# EAGLE design 5G8_fpv_tx (EAGLE 7.2.0)
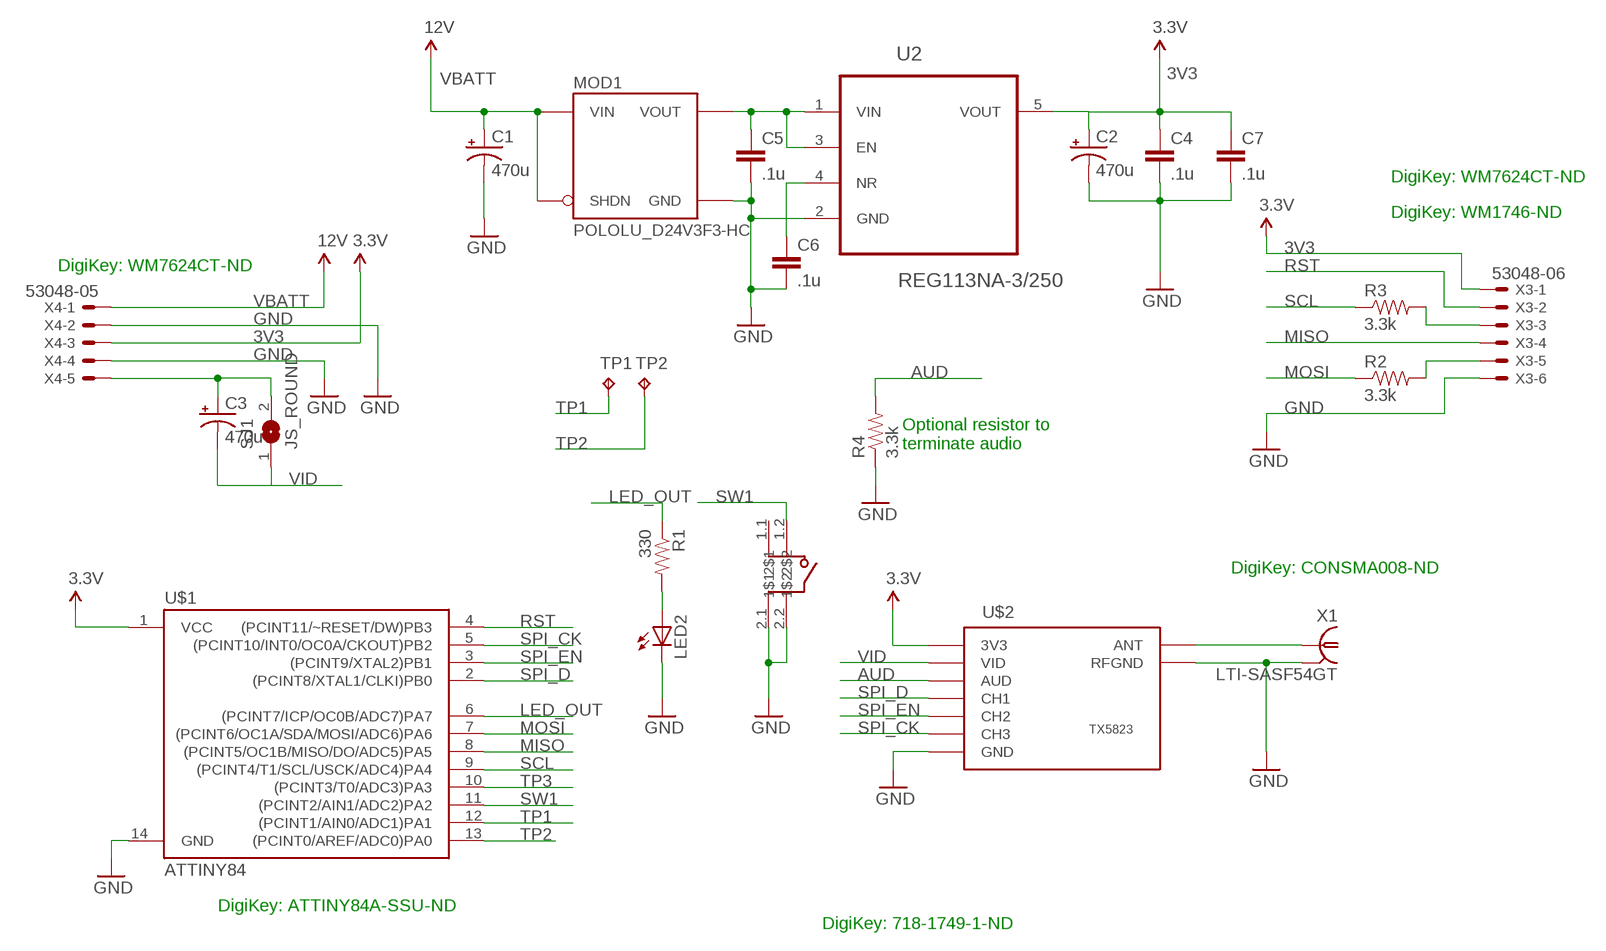
[diagram p0: schematic, sheet 1]

## Parts
C1  470u  VISHAY_D  [VISHAY_D]
C2  470u  VISHAY_D  [VISHAY_D]
C3  470u  VISHAY_D  [VISHAY_D]
C4  .1u  CAP0805  [0805]
C5  .1u  CAP0805  [0805]
C6  .1u  CAP0805  [0805]
C7  .1u  CAP0805  [0805]
LED2  LEDCHIPLED_0805  [CHIPLED_0805]
MOD1  POLOLU_D24V3F3-HC  [POLOLU_D24V3F_HC]
R1  330  RESISTOR0805-RES  [0805]
R2  3.3k  RESISTOR0805-RES  [0805]
R3  3.3k  RESISTOR0805-RES  [0805]
R4  3.3k  RESISTOR0805-RES  [0805]
SJ1  JS_ROUND  [SJ_ROUND]
TP1  TPTP06SQ  [TP06SQ]
TP2  TPTP06SQ  [TP06SQ]
U2  REG113NA-3/250  [SOT95P280X145-5N]
U$1  ATTINY84  [SO14]
U$2  TX5823  [TX5823]
U$3  BOURNS_7814G_SW  [7914G]
X1  LTI-SASF54GT  [LTI-SASF54GT]
X3  53048-06  [53048-06]
X4  53048-05  [53048-05]

## Nets
3V3: C2.+ C4.1 C7.1 U2.5(VOUT) U$1.1(VCC) U$2.P$4(3V3) X3.1 X4.3 ; supply symbol labelled 3.3V
ANT: U$2.P$10(ANT) X1.1
AUD: R4.2 U$2.P$2(AUD)
GND: C1.- C2.- C4.2 C5.2 C6.2 C7.2 LED2.C MOD1.G(GND) R4.1 U2.2(GND) U$1.14(GND) U$2.P$3(GND) U$2.P$5(GND) U$2.P$9(RFGND) U$2.P$11(RFGND) U$3.2.1(2$1) U$3.2.2(2$2) X1.2 X1.3 X1.4 X1.5 X3.6 X4.2 X4.4
LED: LED2.A R1.2
LED_OUT: R1.1 U$1.6((PCINT7/ICP/OC0B/ADC7)PA7)
MISO: U$1.8((PCINT5/OC1B/MISO/DO/ADC5)PA5) X3.4
MOSI: R2.1 U$1.7((PCINT6/OC1A/SDA/MOSI/ADC6)PA6)
MOSI_: R2.2 X3.5
N$1: C5.1 MOD1.O(VOUT) U2.1(VIN) U2.3(EN)
N$2: C6.1 U2.4(NR)
RST: U$1.4((PCINT11/~RESET/DW)PB3) X3.2
SCL: R3.1 U$1.9((PCINT4/T1/SCL/USCK/ADC4)PA4)
SCL_: R3.2 X3.3
SPI_CK: U$1.5((PCINT10/INT0/OC0A/CKOUT)PB2) U$2.P$8(CH3)
SPI_D: U$1.2((PCINT8/XTAL1/CLKI)PB0) U$2.P$6(CH1)
SPI_EN: U$1.3((PCINT9/XTAL2)PB1) U$2.P$7(CH2)
SW1: U$1.11((PCINT2/AIN1/ADC2)PA2) U$3.1.2(1$2)
TP1: TP1.TP U$1.12((PCINT1/AIN0/ADC1)PA1)
TP2: TP2.TP U$1.13((PCINT0/AREF/ADC0)PA0)
TP3: U$1.10((PCINT3/T0/ADC3)PA3)
VBATT: C1.+ MOD1.I(VIN) MOD1.S(SHDN) X4.1 ; supply symbol labelled 12V
VID: C3.- SJ1.1 U$2.P$1(VID)
VID_IN: C3.+ SJ1.2 X4.5
Unconnected: U$3.1.1(1$1)

## Notes on the sheet
- DigiKey: WM7624CT-ND
- DigiKey: WM1746-ND
- DigiKey: WM7624CT-ND
- Optional resistor to
  terminate audio
- DigiKey: CONSMA008-ND
- DigiKey: ATTINY84A-SSU-ND
- DigiKey: 718-1749-1-ND

## Library data of the parts
C1-C3 = 5G8_fpv:VISHAY_D
C4-C7 = SparkFun-Passives:CAP: Capacitor Standard 0603 ceramic capacitor, and 0.1" leaded capacitor.
LED2 = led:LED: LED OSRAM: - CHIPLED LG R971, LG N971, LY N971, LG Q971, LY Q971, LO R971, LY R971 LH N974, LH R974 LS Q976, LO Q976, LY Q976 LO Q996 - Hyper CHIPLED LW Q18S LB Q993, LB Q99A, LB R99A - SideLED LS A670, LO A670, LY A670, LG A670, LP A670 LB A673, LV A673, LT A673, LW A673 LH A674 LY A675 LS A676, LA A676, LO A676, LY A676, LW A676 LS A679, LY A679, LG A679 - Hyper Micro SIDELED® LS Y876, LA Y876, LO Y876, LY Y876 LT Y87S - SmartLED LW L88C, LW L88S LB L89C, LB L89S, LG L890 LS L89K, LO L89K, LY L89K LS L896, LA L896, LO L896, LY L896 - TOPLED LS T670, LO T670, LY T670, LG T670, LP T670 LSG T670, LSP T670, LSY T670, LOP T670, LYG T670 LG T671, LOG T671, LSG T671 LB T673, LV T673, LT T673, LW T673 LH T674 LS T676, LA T676, LO T676, LY T676, LB T676, LH T676, LSB T676, LW T676 LB T67C, LV T67C, LT T67C, LS T67K, LO T67K, LY T67K, LW E67C LS E67B, LA E67B, LO E67B, LY E67B, LB E67C, LV E67C, LT E67C LW T67C LS T679, LY T679, LG T679 LS T770, LO T770, LY T770, LG T770, LP T770 LB T773, LV T773, LT T773, LW T773 LH T774 LS E675, LA E675, LY E675, LS T675 LS T776, LA T776, LO T776, LY T776, LB T776 LHGB T686 LT T68C, LB T68C - Hyper Mini TOPLED® LB M676 - Mini TOPLED Santana® LG M470 LS M47K, LO M47K, LY M47K Source: http://www.osram.convergy.de LUXEON: - LUMILED® LXK2-PW12-R00, LXK2-PW12-S00, LXK2-PW14-U00, LXK2-PW14-V00 LXK2-PM12-R00, LXK2-PM12-S00, LXK2-PM14-U00 LXK2-PE12-Q00, LXK2-PE12-R00, LXK2-PE12-S00, LXK2-PE14-T00, LXK2-PE14-U00 LXK2-PB12-K00, LXK2-PB12-L00, LXK2-PB12-M00, LXK2-PB14-N00, LXK2-PB14-P00, LXK2-PB14-Q00 LXK2-PR12-L00, LXK2-PR12-M00, LXK2-PR14-Q00, LXK2-PR14-R00 LXK2-PD12-Q00, LXK2-PD12-R00, LXK2-PD12-S00 LXK2-PH12-R00, LXK2-PH12-S00 LXK2-PL12-P00, LXK2-PL12-Q00, LXK2-PL12-R00 Source: www.luxeon.com KINGBRIGHT: KA-3528ASYC Source: www.kingbright.com
MOD1 = Pololu:POLOLU_D24V3F*: Pololu Step Down Voltage Regulators Series D24V3F_ (300 mA) 0.4"x0.5" SOURCE www.pololu.com/ PACKAGE THT; 4-pin (0.1"); 0.4"x0.5" TECHNOLOGIES D24V3F… Vo/V Vi/V (for max. Io) X: (generic) 3: 3.3 3.8 ( 4.3) … 42.0 5: 5.0 6.0 ( 6.5) … 42.0 9: 9.0 10.5 (12.5) … 42.0 12: 12.0 14.0 (17.5) … 42.0 Io: 300 mA; Quiescent Current: 2 mA (SHDN: 20 uA) Author: Dipl.-Ing. FH Rainer Bayer
R1-R4 = SparkFun-Passives:RESISTOR: Resistor Basic schematic elements and footprints for 0603, 1206, and PTH resistors.
SJ1 = 5G8_fpv:JS_ROUND
TP1 TP2 = testpad:TP: Test pad
U2 = Texas Instruments_By_element14_Batch_1:REG113NA-3/250: DMOS 400mA Low-Dropout Regulator; MPN: REG113NA-3/250; OC_FARNELL: 1575540; OC_NEWARK: 75C7591; PACKAGE: SOT-23-5; SUPPLIER: Texas Instruments
U$1 = SparkFun-DigitalIC:ATTINY84: Atmel 14-pin 2/4/8kB flash uC; PROD_ID: IC-11285
U$2 = 5G8_fpv:TX5823
U$3 = 5G8_fpv:BOURNS_7814G_SW
X1 = con-coax:LTI-SASF54GT: SMA vertical PCB thrue hole jack Source: Lighthorse Technologies, inc. SASF54GT.pdf; OC_FARNELL: unknown; OC_NEWARK: unknown
X3 = con-molex:53?-06: CONNECTOR wire to board 1.25 mm (.049 inch) pitch header; MF: WALDOM/MOLEX; MPN: 53048-0610; OC_FARNELL: 1012260; OC_NEWARK: 38C9911
X4 = con-molex:53?-05: CONNECTOR wire to board 1.25 mm (.049 inch) pitch header; MF: MOLEX; MPN: 53048-0510; OC_FARNELL: 9732926; OC_NEWARK: 57H4722

## Board
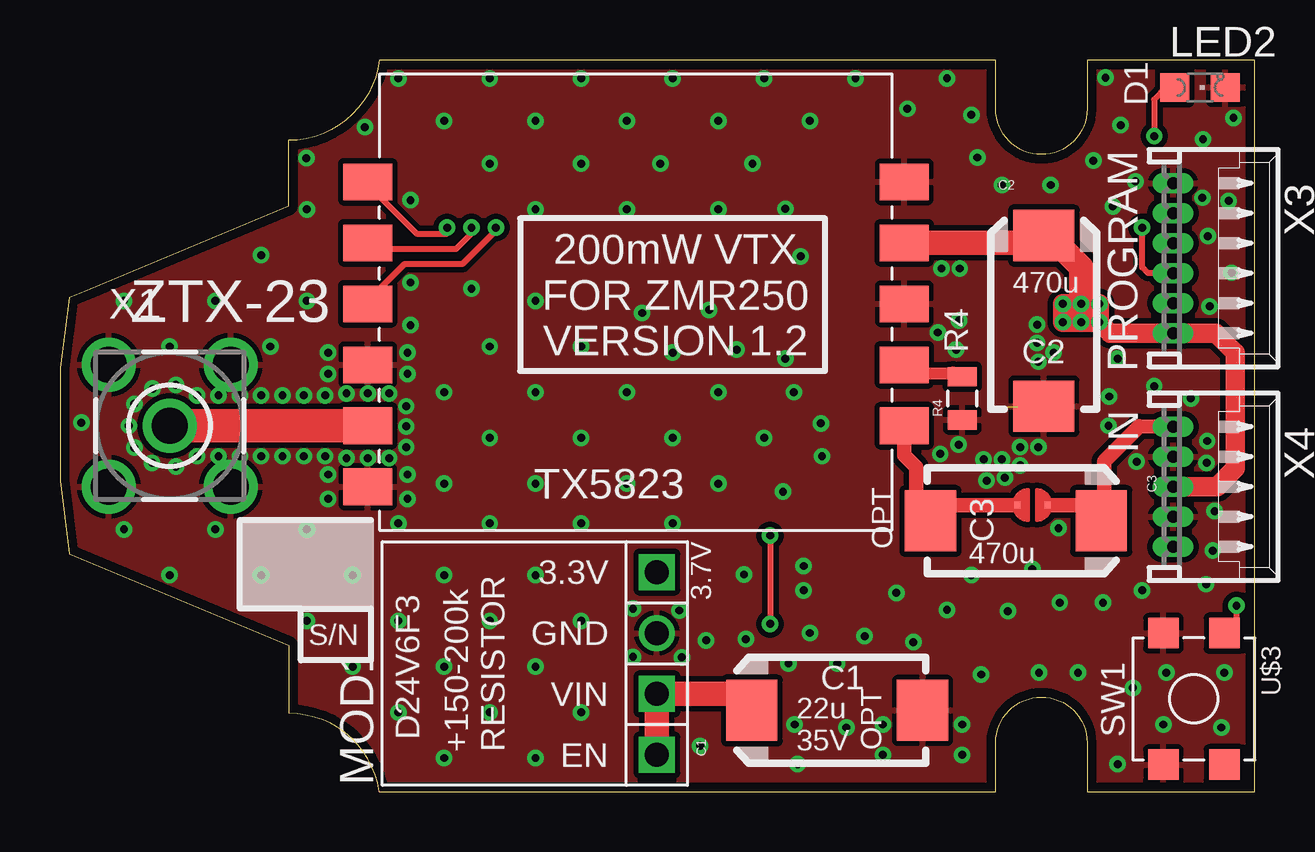
[diagram p1: board, top side]
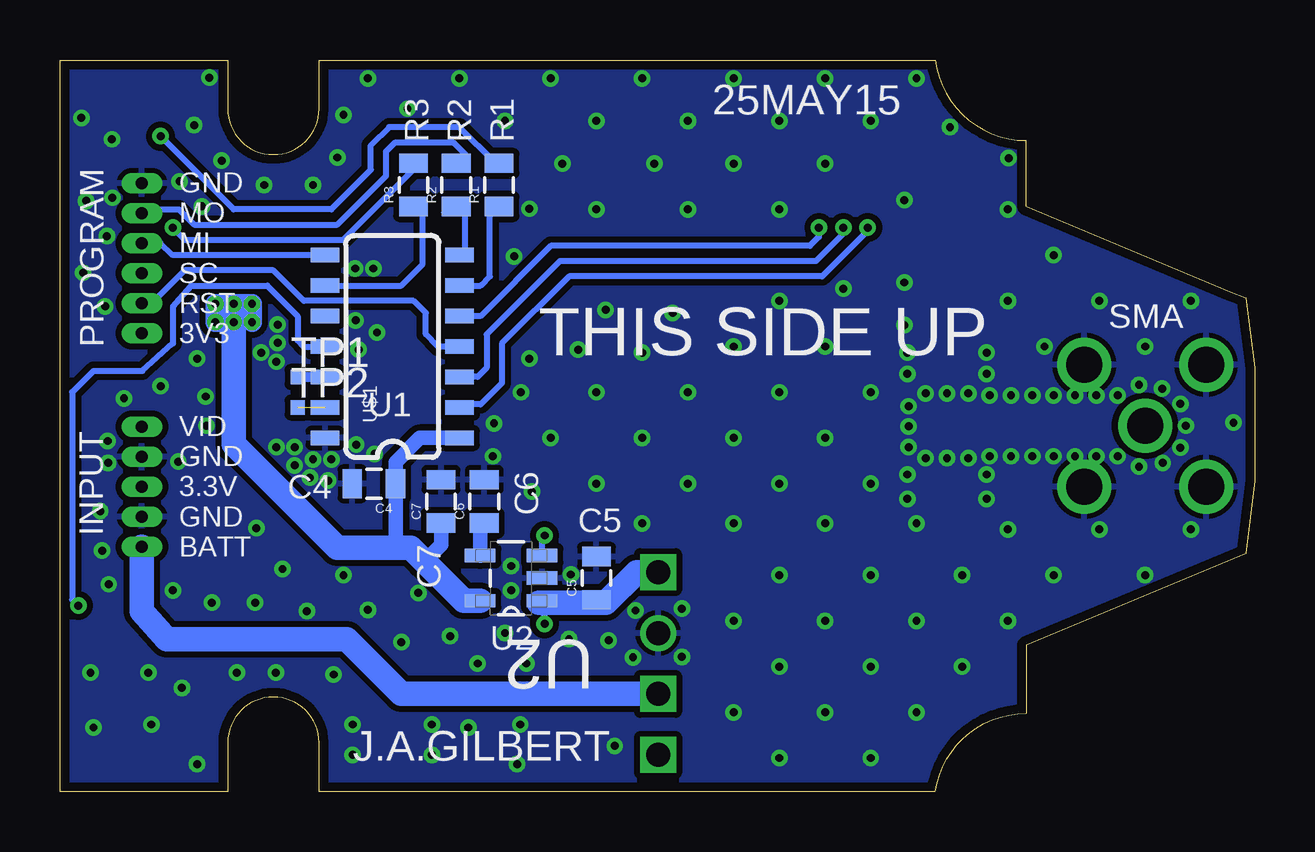
[diagram p2: board, bottom side, seen from below]

Size 49.78 x 30.48 mm. Coordinates in mm from the lower left corner, seen from the top.
Outline: 0.38,9.91 9.53,6.1 9.53,3.25 arc-82 13.31,0 38.99,0 38.99,2.03 arc-180 42.8,2.03 42.8,0 49.78,0 49.78,30.48 42.8,30.48 42.8,28.45 arc-180 38.99,28.45 38.99,30.48 13.31,30.48 arc-83 9.53,27.13 9.53,24.38 1.02,20.83 0.38,20.57 0,17.65 0,12.95 0.38,9.91
Copper layers (1*16): Top 0.0356mm / dielectric 1.5011mm / Bottom 0.0356mm
Design rules "oshpark-2layer *": minimum track width 6mil, minimum drill 13mil, track to track 6mil, track to pad 6mil, pad to pad 6mil, via to via 6mil, smd to smd 6mil, copper to edge 15mil, drill to drill 6mil, minimum pad ring 7mil, minimum via ring 7mil, stop-mask expansion 4mil, vias tented up to drill 20mil, thermal gap 8mil

### Footprints (pad centres in the part's own frame; a part is rotated, then mirrored left to right if it is on the bottom)
VISHAY_D = smd 2.54 x 2.134: + 0,3.556; - 0,-3.556
0805 = smd 0.8 x 1.2: 1 -0.9,0; 2 0.9,0
CHIPLED_0805 = smd 1.2 x 1.2: A 0,-1.05; C 0,1.05
POLOLU_D24V3F_HC = drill 1: G 1.27,-5.715 | drill 1 square: I -1.27,-5.715; O 3.81,-5.715; S -3.81,-5.715
SJ_ROUND = smd 0.254 x 0.254: 1 -0.635,0; 2 0.635,0
TP06SQ = smd 0.6 x 0.6: TP 0,0
SOT95P280X145-5N = smd 1.27 x 0.559: 1 -1.295,0.94; 2 -1.295,0; 3 -1.295,-0.94; 4 1.295,-0.94; 5 1.295,0.94
SO14 = smd 0.6 x 1.2: 1 -3.81,-2.8; 2 -2.54,-2.8; 3 -1.27,-2.8; 4 0,-2.8; 5 1.27,-2.8; 6 2.54,-2.8; 7 3.81,-2.8; 8 3.81,2.8; 9 2.54,2.8; 10 1.27,2.8; 11 0,2.8; 12 -1.27,2.8; 13 -2.54,2.8; 14 -3.81,2.8
TX5823 = smd 2.032 x 1.524: P$1 0,0; P$2 0,-2.54; P$3 0,-5.08; P$4 0,-7.62; P$5 0,-10.16; P$6 22.352,-10.16; P$7 22.352,-7.62; P$8 22.352,-5.08; P$9 22.352,-2.54; P$10 22.352,0; P$11 22.352,2.54
7914G = smd 1.27 x 1.27: 1.1 0,5.486; 1.2 0,0; 2.1 2.54,5.486; 2.2 2.54,0
LTI-SASF54GT = drill 1.5 pad 2.2: 1 0,0; 2 -2.54,2.54; 3 2.54,2.54; 4 2.54,-2.54; 5 -2.54,-2.54
53048-06 = drill 0.5 pad 0.698 long: 1 3.125,-1.25; 2 1.875,-1.25; 3 0.625,-1.25; 4 -0.625,-1.25; 5 -1.875,-1.25; 6 -3.125,-1.25
53048-05 = drill 0.5 pad 0.698 long: 1 2.5,-1.25; 2 1.25,-1.25; 3 0,-1.25; 4 -1.25,-1.25; 5 -2.5,-1.25

### Placement (x,y rotation side)
C1  32.39,3.38 90 top
C2  41,19.61 0 top
C3  39.83,11.28 270 top
C4  36.7,12.83 180 bottom
C5  27.43,8.89 90 bottom
C6  32.11,12.09 90 bottom
C7  33.91,12.09 90 bottom
LED2  47.5,29.34 270 top
MOD1  19.15,5.33 90 top
R1  31.5,25.27 90 bottom
R2  33.27,25.27 90 bottom
R3  35.05,25.27 90 bottom
R4  37.59,16.38 90 top
SJ1  40.51,11.94 0 top
TP1  39.88,17.27 0 bottom
TP2  39.88,16 0 bottom
U2  30.99,8.89 180 bottom
U$1  35.94,18.54 90 bottom
U$2  35.18,15.24 180 top
U$3  48.51,6.6 180 top
X1  4.57,15.24 0 top
X3  47.62,22.23 270 top
X4  47.62,12.7 270 top

### Tracks (layer width: path | path; a pad name or v marks a point on that pad's centre or on a via)
3V3  (via drill 0.33)
  Top 0.813: X4.3 48.21,12.7 48.97,13.46 48.97,18.29 48.16,19.1 X3.1 43.77,19.1 v43.31,19.56 | v43.31,19.56 v43.31,20.32 v42.55,20.32 v41.78,20.32 v41.78,19.56 v43.31,19.56
  Top 1.016: C2.+ 40.64,22.86 | 40.64,22.86 U$2.P$4 | 40.64,22.86 41.53,22.86 42.55,21.84 v42.55,20.32
  Bottom 0.61: U$1.1 34.8,14.73 35.8,13.73 C4.1 35.8,10.16 35.69,10.16 | C7.1 33.91,10.29 34.61,9.59
  Bottom 0.813: v42.55,19.56 v43.31,19.56 v43.31,20.32 v42.55,20.32 v41.78,20.32 v41.78,19.56
  Bottom 1.016: v42.55,19.56 42.55,14.48 38.23,10.16 35.69,10.16 35.18,10.16 34.61,9.59 32.97,7.95 U2.5
ANT
  Top 1.397: U$2.P$10 X1.1
AUD
  Top 0.508: 37.21,17.4 35.69,17.4
  Top 0.61: R4.2 37.21,17.4 | 35.69,17.4 arc-90 35.43,17.78 U$2.P$2
GND  (via drill 0.33)
  other vias: 44.86,13.74 8.38,13.97 7.49,13.97 6.6,13.97 5.71,13.97 5.71,16.51 6.6,16.51 7.49,16.51 8.38,16.51 3.86,16.79 6.48,20.45 40.77,17.91 14.43,15.21 9.27,16.51 9.27,13.97 4.83,16.94 3.1,16.15 3.84,13.69 4.83,13.54 2.87,15.24 3.1,14.33 37.49,21.79 40.77,14.35 41.4,18.29 43.69,15.24 44.07,18.03 14.43,14.35 4.57,18.54 10.29,20.45 2.67,20.45 40.72,19.46 48.69,24.61 43.87,24.38 48.82,21.62 47.9,20.22 47.75,8.64 43.46,7.87 48.39,2.67 45.09,8.38 48.51,4.95 46.1,4.95 43.71,16.46 44.07,1.14 41.66,7.87 8.38,22.35 8.76,18.54 10.29,24.26 2.67,10.92 6.48,10.92 4.57,9.02 8.38,9.02 10.29,7.11 10.29,10.92 12.19,9.02 12.19,5.21 14.1,3.3 16,1.4 19.81,1.4 17.91,3.3 16,5.21 14.1,7.11 16,9.02 14.1,11.18 17.91,7.11 19.81,5.21 21.72,3.3 21.72,7.11 19.81,9.02 21.72,11.18 17.91,11.18 16,12.83 19.81,12.83 21.72,14.73 21.72,18.54 19.81,16.64 17.91,14.73 16,16.64 17.91,18.54 19.81,20.45 14.61,19.43 23.62,24.26 19.81,24.26 17.91,26.16 16,27.94 19.81,27.94 21.72,26.16 23.62,27.94 31.24,27.94 35.31,28.45 37.97,28.19 36.96,29.72 33.15,29.72 29.34,29.72 25.53,29.72 21.72,29.72 17.91,29.72 14.1,29.72 12.7,27.69 0.89,15.37 39.5,7.52 26.67,1.9 37.97,9.02 32.39,5.33 37.59,2.79 34.85,8.28 23.62,16.64 30.12,12.5 23.62,12.83 30.99,9.4 25.53,14.73 24.26,19.94 27.43,12.83 31.7,15.34 40.01,14.35 45.59,16.89 40.79,4.95 25.81,7.54 25.53,11.18 43.56,29.74 48.9,28.07 38.23,26.42 47.83,23.14 47.6,24.74 27.43,16.64 29.34,14.73 23.88,5.61 23.88,7.62 25.91,5.59 36.68,14.07 38.48,13.84 37.34,18.42 36.58,19.13 26.92,6.3 27.05,20.07 25.53,18.29 28.19,18.42 30.58,16.64 30.23,18.03 25.02,26.16 27.43,24.26 43.05,26.29 27.43,27.94 28.5,9.04 28.85,26.16 30.23,24.28 30.86,22.3 44.81,25.43 47.62,27.18 47.12,16.38 48.11,11.68 41.61,10.97 40.51,9.27 35.56,6.22 31.75,13.97 31.24,6.6 28.57,6.35 33.53,6.48 34.29,2.79 30.35,5.33 32.77,2.67 37.59,1.52 44.7,4.32 42.42,4.95 45.97,2.79 30.99,8.38 48.03,10.03 30.73,1.14 34.29,1.52 39.24,25.27 41.28,25.27 14.61,24.64 14.61,21.21 17.14,20.96 44.2,27.76 30.61,2.79 14.48,17.4 14.48,18.29 11.18,18.29 11.18,17.4 11.18,13.21 11.18,12.19 14.48,12.19 14.48,13.21 14.43,16.05 10.26,26.39 10.16,13.97 11.05,13.97 10.16,16.51 11.05,16.51 11.94,16.59 12.83,16.59 13.72,16.59 11.94,13.89 12.83,13.89 13.72,13.89 47.78,13.69 47.8,14.6 36.96,7.57 38.38,4.88 36.73,21.79 37.47,19.63 40.72,18.69 39.24,13.84 37.44,14.45 39.37,13.08 40.01,13.59 38.61,12.95
  pour Top (isolate 0.229): -0.25,30.48 -0.25,0 50.55,0 50.55,30.48
  pour Bottom (isolate 0.254): -0.25,30.48 -0.25,0 50.55,0 50.55,30.48
LED  (via drill 0.33)
  Top 0.254: LED2.A 46.1,29.34 45.59,28.83 v45.59,27.3
  Bottom 0.254: v45.59,27.3 42.55,24.26 38.48,24.26 36.83,25.91 36.83,26.92 36.07,27.69 33.15,27.69 31.63,26.17 R1.2
LED_OUT
  Bottom 0.254: U$1.6 32.26,21.08 31.88,21.46 31.88,23.99 R1.1
MISO
  Bottom 0.254: 38.99,22.35 U$1.8 45.09,22.35 45.6,22.85 X3.4
MOSI
  Bottom 0.254: 33.78,24.12 R2.1 32.89,24.12 32.89,22.35 U$1.7
MOSI_
  Bottom 0.254: X3.5 46,24.1 45.85,24.26 44.83,24.26 44.2,23.62 38.23,23.62 36.2,25.65 36.2,26.67 35.81,27.05 33.4,27.05 32.89,26.54 R2.2
N$1  (via drill 0.33)
  Top 0.254: v29.59,10.67 v29.59,6.98
  Bottom 0.254: U2.3 29.69,10.67 v29.59,10.67 | v29.59,6.98 29.59,7.95 U2.1
  Bottom 0.61: 29.85,7.87 29.69,7.64 U2.1 | C5.1 27.05,7.87
  Bottom 1.016: MOD1.O 25.76,9.14 27.05,7.87 29.85,7.87
N$2
  Bottom 0.61: U2.4 32.28,10.89 C6.1
RST
  Bottom 0.254: U$1.4 34.04,18.54 34.54,19.05 34.54,19.94 35.05,20.45 39.62,20.45 40.89,21.72 44.58,21.72 45.97,20.32 46.85,20.32 X3.2
SCL
  Bottom 0.254: U$1.9 35.56,21.08 34.67,21.97 34.67,24.12 R3.1
SCL_  (via drill 0.33)
  Top 0.254: X3.3 45.33,21.6 45.09,21.84 v45.09,23.5
  Bottom 0.254: v45.09,23.5 44.58,22.99 37.97,22.99 35.04,25.92 R3.2
SPI_CK  (via drill 0.33)
  Top 0.254: v18.16,23.5 18.16,23.37 16.76,21.97 14.35,21.97 12.83,20.45 U$2.P$8
  Bottom 0.254: v18.16,23.5 18.16,23.11 18.54,22.73 29.34,22.73 32.26,19.81 U$1.5
SPI_D  (via drill 0.33)
  Top 0.254: U$2.P$6 12.83,25.27 14.86,23.24 16.13,23.24 v16.13,23.5
  Bottom 0.254: v16.13,23.5 16.13,23.37 18.03,21.46 28.57,21.46 31.37,18.67 31.37,17.02 32.26,16.13 33.27,16.13 U$1.2
SPI_EN  (via drill 0.33)
  Top 0.254: U$2.P$7 13.59,22.61 16.51,22.61 17.14,23.24 v17.14,23.5
  Bottom 0.254: v17.14,23.5 17.14,23.24 18.29,22.1 28.96,22.1 32,19.05 32,17.65 32.39,17.27 U$1.3
SW1  (via drill 0.33)
  Top 0.254: U$3.1.2 49.02,6.6 v49.02,7.75
  Bottom 0.254: v49.02,7.75 49.28,8 49.28,16.64 48.39,17.53 46.36,17.53 45.09,18.67 45.09,20.19 44.32,21.08 41.15,21.08 39.88,19.81 39.88,18.8 39.62,18.54 U$1.11
TP1
  Bottom 0.406: TP1.TP U$1.12
TP2  (1 unrouted)
VBATT
  Top 1.016: C1.+ 29.13,4.06 MOD1.I MOD1.S
  Bottom 1.016: MOD1.I 35.56,4.06 37.85,6.35 45.34,6.35 46.38,7.51 X4.1
VID
  Top 0.61: U$2.P$1 35.18,14.02 35.69,13.51 35.69,11.94 | 35.69,11.94 35.69,11.48 C3.- | SJ1.1 35.69,11.94
VID_IN
  Top 0.61: 43.51,12.45 43.51,12.14 C3.+ 43.64,11.84 | 43.51,12.45 43.51,13.76 44.97,15.21 X4.5 | SJ1.2 43,11.94 43.51,12.45

### Text on the board
tPlace: D1 | 200mW VTX / FOR ZMR250 / VERSION 1.2 | 470u | ZTX-23 | R4 | C2 | PROGRAM | IN | C3 | 3.7V | OPT | 470u | S/N | 3.3V / GND / VIN / EN | SW1 | C1 | D24V6F3 | 22u / 35V | OPT | +150-200k / RESISTOR
bPlace: 25MAY15 | R1 | R2 | R3 | SMA | THIS SIDE UP | GND / MO / MI / SC / RST / 3V3 | PROGRAM | U1 | C6 | C4 | C5 | C7 | VID / GND / 3.3V / GND / BATT | INPUT | U2 | J.A.GILBERT